# Altium schematic sheet main.SchDoc
size A4
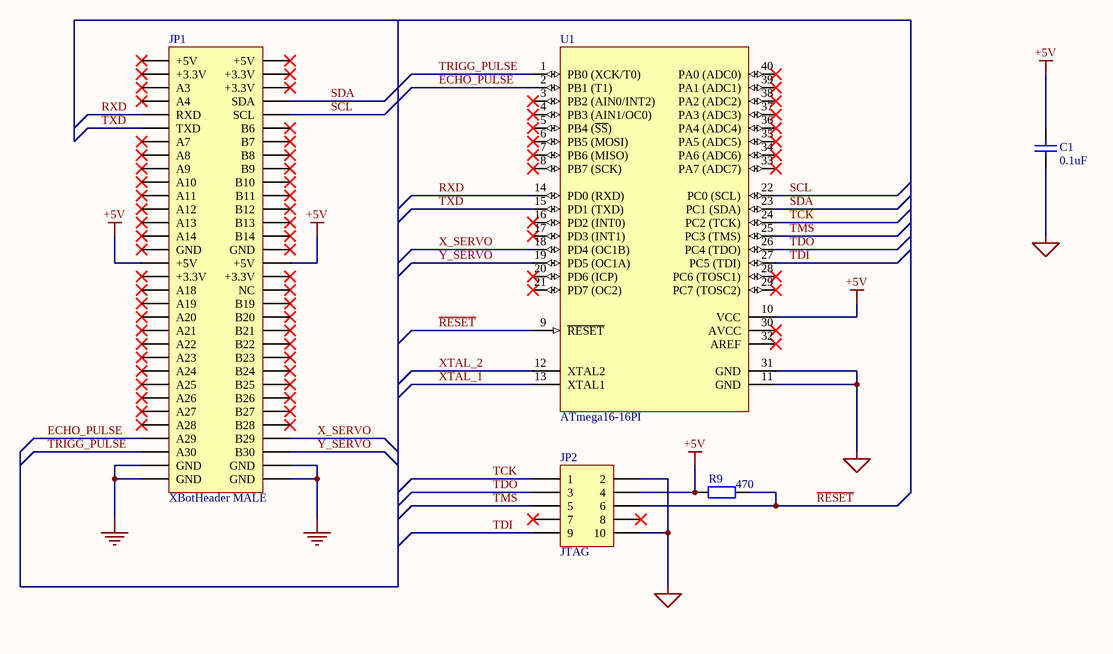
[diagram p0: main.SchDoc]

## Parts
C1  value 0.1uF  [CR2012-0805]  (hidden comment: Cap Semi_16pF)
JP1  XBotHeader MALE  [DIN 41 612 - MALE Type B]
JP2  JTAG  [HDR2X5]
R9  value 470  [CR2012-0805]  (hidden comment: Res Semi)
U1  ATmega16-16PI  [40P6]

## Nets
+5V: C1.2 JP1.A16(+5V) JP1.B16(+5V) JP2.4 R9.2 U1.10(VCC)
GND: C1.1 JP1.A31(GND) JP1.A32(GND) JP1.B31(GND) JP1.B32(GND) JP2.2 JP2.10 U1.11(GND) U1.31(GND)
~{RESET}: JP2.6 R9.1 U1.9(~{RESET})
ECHO_PULSE: JP1.A29 U1.2(PB1_(T1))
RXD: JP1.A5(RXD) U1.14(PD0_(RXD))
SCL: JP1.B5(SCL) U1.22(PC0_(SCL))
SDA: JP1.B4(SDA) U1.23(PC1_(SDA))
TCK: JP2.1 U1.24(PC2_(TCK))
TDI: JP2.9 U1.27(PC5_(TDI))
TDO: JP2.3 U1.26(PC4_(TDO))
TMS: JP2.5 U1.25(PC3_(TMS))
TRIGG_PULSE: JP1.A30 U1.1(PB0_(XCK/T0))
TXD: JP1.A6(TXD) U1.15(PD1_(TXD))
X_SERVO: JP1.B29 U1.18(PD4_(OC1B))
XTAL_1: U1.13(XTAL1)
XTAL_2: U1.12(XTAL2)
Y_SERVO: JP1.B30 U1.19(PD5_(OC1A))

Not connected (* = marked no-connect by the designer): JP1 A1(+5V)* A2(+3.3V)* A3* A4* A7* A8* A9* A10* A11* A12* A13* A14* A15(GND)* A17(+3.3V)* A18* A19* A20* A21* A22* A23* A24* A25* A26* A27* A28* B1(+5V)* B2(+3.3V)* B3(+3.3V)* B6* B7* B8* B9* B10* B11* B12* B13* B14* B15(GND)* B17(+3.3V)* B18(NC)* B19* B20* B21* B22* B23* B24* B25* B26* B27* B28*; JP2 7* 8*; U1 3(PB2_(AIN0/INT2))* 4(PB3_(AIN1/OC0))* 5(PB4_(~{SS}))* 6(PB5_(MOSI))* 7(PB6_(MISO))* 8(PB7_(SCK))* 16(PD2_(INT0))* 17(PD3_(INT1))* 20(PD6_(ICP))* 21(PD7_(OC2))* 28(PC6_(TOSC1))* 29(PC7_(TOSC2))* 30(AVCC)* 32(AREF)* 33(PA7_(ADC7))* 34(PA6_(ADC6))* 35(PA5_(ADC5))* 36(PA4_(ADC4))* 37(PA3_(ADC3))* 38(PA2_(ADC2))* 39(PA1_(ADC1))* 40(PA0_(ADC0))*

## Library data of the parts
C1 = Cap Semi: Capacitor (Semiconductor SIM Model); Published: 8-Jun-2000; Revision: July-2002: Re-released for DXP Platform.; Publisher: Altium Limited
JP1 = XBotHeaderMale: Header, 32-Pin, Dual row; Manufacturer: Generic Components; Class I: Connector; ELFA: 111; Revision: July-2002: Re-released for DXP Platform.; Publisher: Altium Limited
JP2 = Header 5X2: Header, 5-Pin, Dual row; LatestRevisionDate: 17-Jul-2002; LatestRevisionNote: Re-released for DXP Platform.; Publisher: Altium Limited
R9 = Res Semi: Semiconductor Resistor; Published: 8-Jun-2000; Revision: July-2002: Re-released for DXP Platform.; Publisher: Altium Limited
U1 = ATmega16-16PI: 8-Bit AVR Microcontroller with 16K Bytes of In-System Programmable Flash Memory; Published: 17-Sep-2003; LatestRevisionDate: 4-Mar-2005; LatestRevisionNote: Stylized 3D Model Added.; DatasheetDocument: 2466E-AVR-10/02; PackageDocument: Dec-1999; PackageReference: 40P6; Publisher: Altium Limited; ComponentLink1Description: Manufacturer Link; ComponentLink1URL: http://www.atmel.com; ComponentLink2Description: Datasheet; ComponentLink2URL: http://www.atmel.com/dyn/resources/prod_documents/doc2466.pdf